# EAGLE design RF_TransimpedanceAmp_FDS02 (EAGLE 6.5.0)
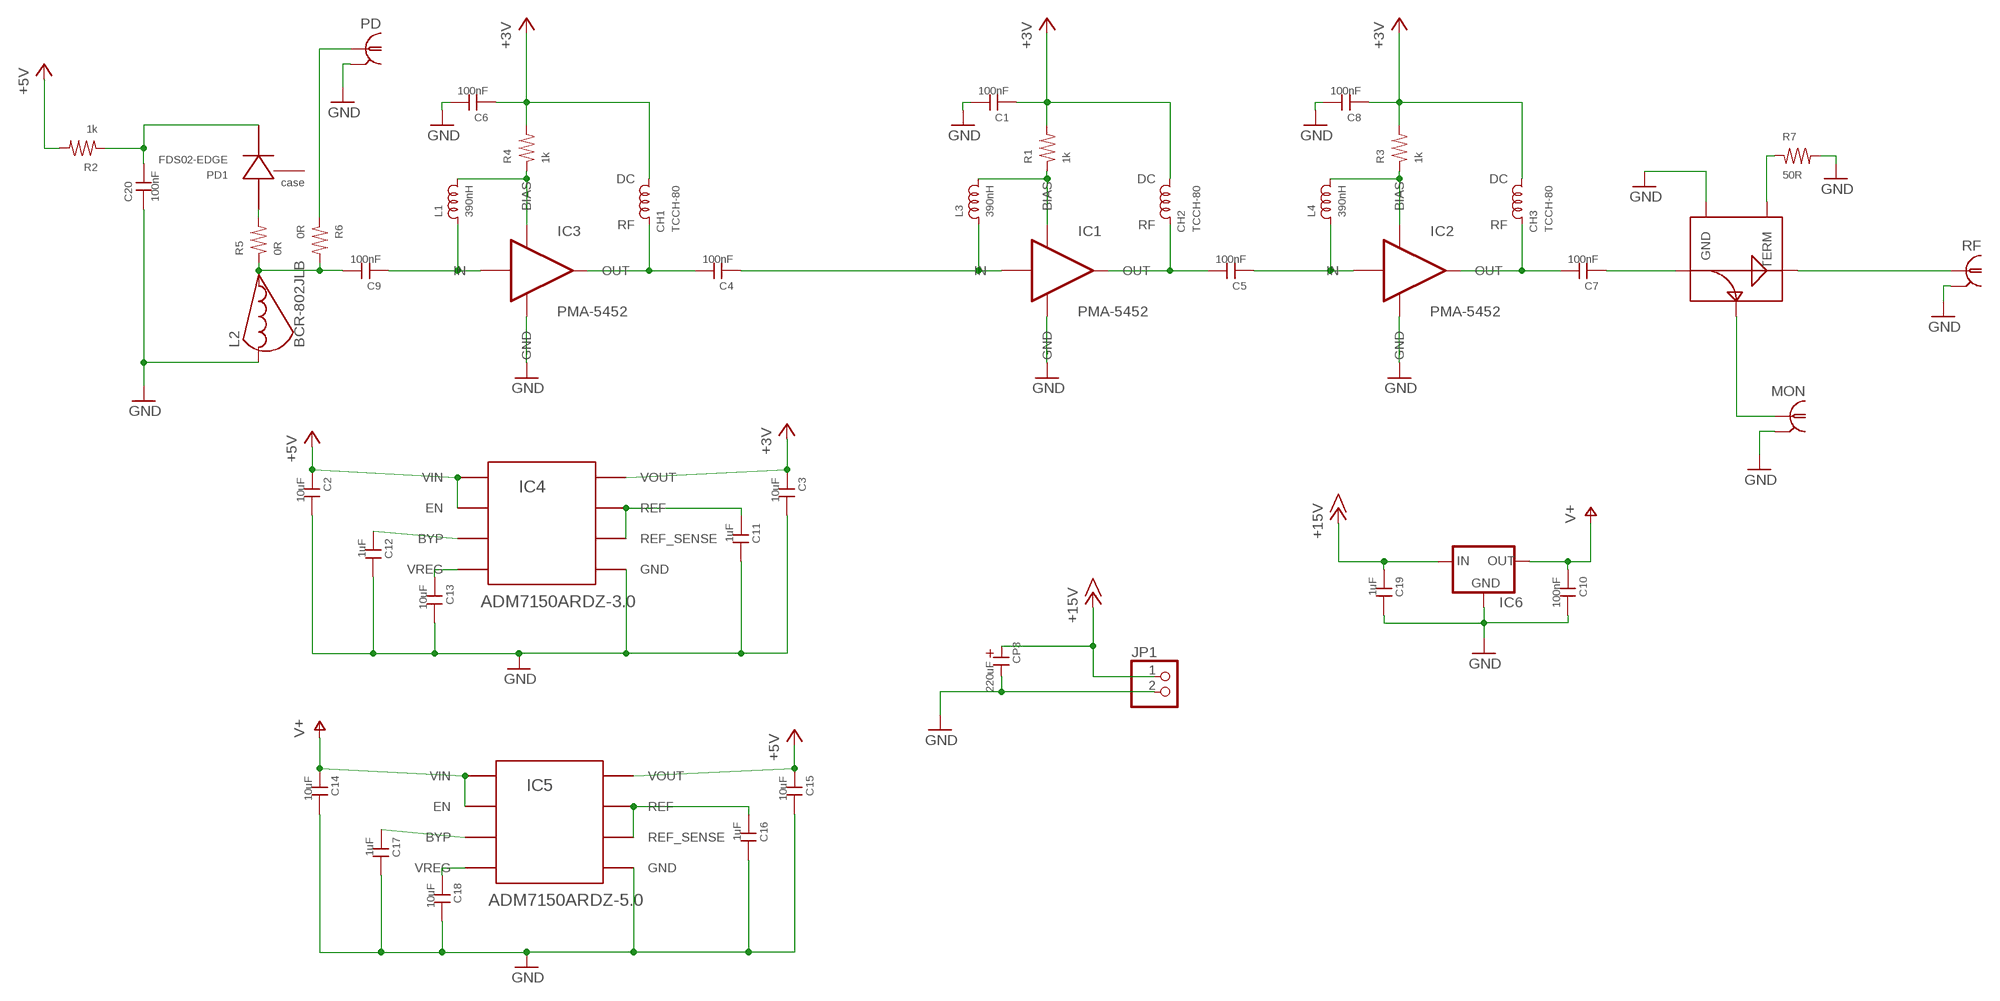
[diagram p0: schematic, sheet 1]

## Parts
C1  100nF  CAP0402  [0402]
C2  10uF  CAP1210  [1210]
C3  10uF  CAP1210  [1210]
C4  100nF  CAP0402  [0402]
C5  100nF  CAP0402  [0402]
C6  100nF  CAP0402  [0402]
C7  100nF  CAP0402  [0402]
C8  100nF  CAP0402  [0402]
C9  100nF  CAP0402  [0402]
C10  100nF  CAP0603  [0603]
C11  1uF  CAP0603  [0603]
C12  1uF  CAP0603  [0603]
C13  10uF  CAP1210  [1210]
C14  10uF  CAP1210  [1210]
C15  10uF  CAP1210  [1210]
C16  1uF  CAP0603  [0603]
C17  1uF  CAP0603  [0603]
C18  10uF  CAP1210  [1210]
C19  1uF  CAP0603  [0603]
C20  100nF  CAP0402  [0402]
CH1  TCCH-80  [GU1604]
CH2  TCCH-80  [GU1604]
CH3  TCCH-80  [GU1604]
CP3  220uF  CAP-POLPANASONIC_F  [PANASONIC_F]
IC1  PMA-5452  [DQ849]
IC2  PMA-5452  [DQ849]
IC3  PMA-5452  [DQ849]
IC4  ADM7150ARDZ-3.0  ADM7150  [SO08]
IC5  ADM7150ARDZ-5.0  ADM7150  [SO08]
IC6  78XX-TO220  [TO220]
JP1  PINHD-1X2  [1X02]
L1  390nH  INDUCTOR-0402  [0402]
L2  BCR-802JLB  [BCR-MED]
L3  390nH  INDUCTOR-0402  [0402]
L4  390nH  INDUCTOR-0402  [0402]
MON  SMAJ502-bulkhead  SMAJ502  [SMA-EDGE]
PD  SMAJ502-bulkhead  SMAJ502  [SMA-EDGE]
PD1  FDS02-EDGE  [FDS02-SIDEMOUNT]
R1  1k  RES0402  [0402]
R2  1k  RES0402  [0402]
R3  1k  RES0402  [0402]
R4  1k  RES0402  [0402]
R5  0R  RES0402  [0402]
R6  0R  RES0402  [0402]
R7  50R  RES0603  [0603]
RF  SMAJ502  [SMA-EDGE]
U$1  ADC-10-4  [BH292]

## Nets
+3V: C1.1 C3.1 C6.1 C8.1 CH1.P$3(DC) CH2.P$3(DC) CH3.P$3(DC) IC4.2(VOUT) R1.2 R3.2 R4.2
+5V: C2.1 C15.1 IC4.7(EN) IC4.8(VIN) IC5.2(VOUT) R2.2
+15V: C19.1 CP3.+ IC6.1(IN) JP1.1
GND: C1.2 C2.2 C3.2 C6.2 C8.2 C10.2 C11.2 C12.2 C13.2 C14.2 C15.2 C16.2 C17.2 C18.2 C19.2 C20.1 CP3.- IC1.P$GND(GND) IC2.P$GND(GND) IC3.P$GND(GND) IC4.4(GND) IC5.4(GND) IC6.2(GND) JP1.2 L2.2 MON.G@1 MON.G@2 MON.G@3 MON.G@4 PD.G@1 PD.G@2 PD.G@3 PD.G@4 R7.2 RF.G@1 RF.G@2 RF.G@3 RF.G@4 U$1.P2(GND)
N$1: C11.1 IC4.5(REF_SENSE) IC4.6(REF)
N$2: C5.2 CH2.P$1(RF) IC1.P$6(OUT)
N$3: IC1.P$7(BIAS) L3.2 R1.1
N$4: RF.1 U$1.P6(OUT)
N$5: C20.2 PD1.P$1(CATHODE) R2.1
N$6: C4.2 CH1.P$1(RF) IC3.P$6(OUT)
N$7: C9.2 L2.1 R5.1 R6.2
N$8: C7.2 CH3.P$1(RF) IC2.P$6(OUT)
N$9: IC3.P$7(BIAS) L1.2 R4.1
N$10: IC2.P$7(BIAS) L4.2 R3.1
N$11: C7.1 U$1.P1(IN)
N$12: MON.1 U$1.P3(COUP)
N$13: C12.1 IC4.3(BYP)
N$14: C13.1 IC4.1(VREG)
N$15: C16.1 IC5.5(REF_SENSE) IC5.6(REF)
N$16: PD1.P$3(ANODE) R5.2
N$17: PD.1 R6.1
N$18: C17.1 IC5.3(BYP)
N$19: C18.1 IC5.1(VREG)
N$20: R7.1 U$1.P4(TERM)
RFPD: C9.1 IC3.P$1(IN) L1.1
RFPD1: C4.1 IC1.P$1(IN) L3.1
RFPD2: C5.1 IC2.P$1(IN) L4.1
V+: C10.1 C14.1 IC5.7(EN) IC5.8(VIN) IC6.3(OUT)
Unconnected: PD1.P$2(CASE)

## Library data of the parts
C1-C20 = rlc-jqi:CAP: SMT Capacitor
CH1-CH3 = rf-jqi:TCCH-80: RF Choke. http://www.minicircuits.com/pdfs/TCCH-80+.pdf
CP3 = rlc-jqi:CAP-POL: Polarized SMT Capacitor
IC1-IC3 = rf-jqi:PMA-5452: Minicircuits PMA-5452 low noise figure amplifier. http://www.minicircuits.com/pdfs/PMA-5452+.pdf
IC4 IC5 = regulator-jqi:ADM7150: ADM7150 Ultra-low noise LDO. 1.7nV/rtHz. Fixed output between 1.5V and 5V.
IC6 = regulator-jqi:78XX
JP1 = pinhead:PINHD-1X2: PIN HEADER
L1 L3 L4 = rlc-jqi:INDUCTOR: SMT Inductor.
L2 = coilcraft-jqi:BCR-802JLB: Coilcraft conical inductor. 8.0uH, 3.39 ohms DC. Irms max = 230mA
MON PD = connector-jqi:SMA; PARTNO: CONSMA006.062-ND
PD1 = RF_TransimpedanceAmp:FDS02: FDS02 FDS02 FC-connectorized photodiode. Ref: https://www.thorlabs.us/thorcat/16600/FDS02-SpecSheet.pdf
R1-R7 = rlc-jqi:RES: SMT Resistor
RF = connector-jqi:SMA
U$1 = RF_TransimpedanceAmp:ADC-10-4: ADC-10-4+ Directional coupler: http://www.minicircuits.com/pdfs/ADC-10-4.pdf

## Board
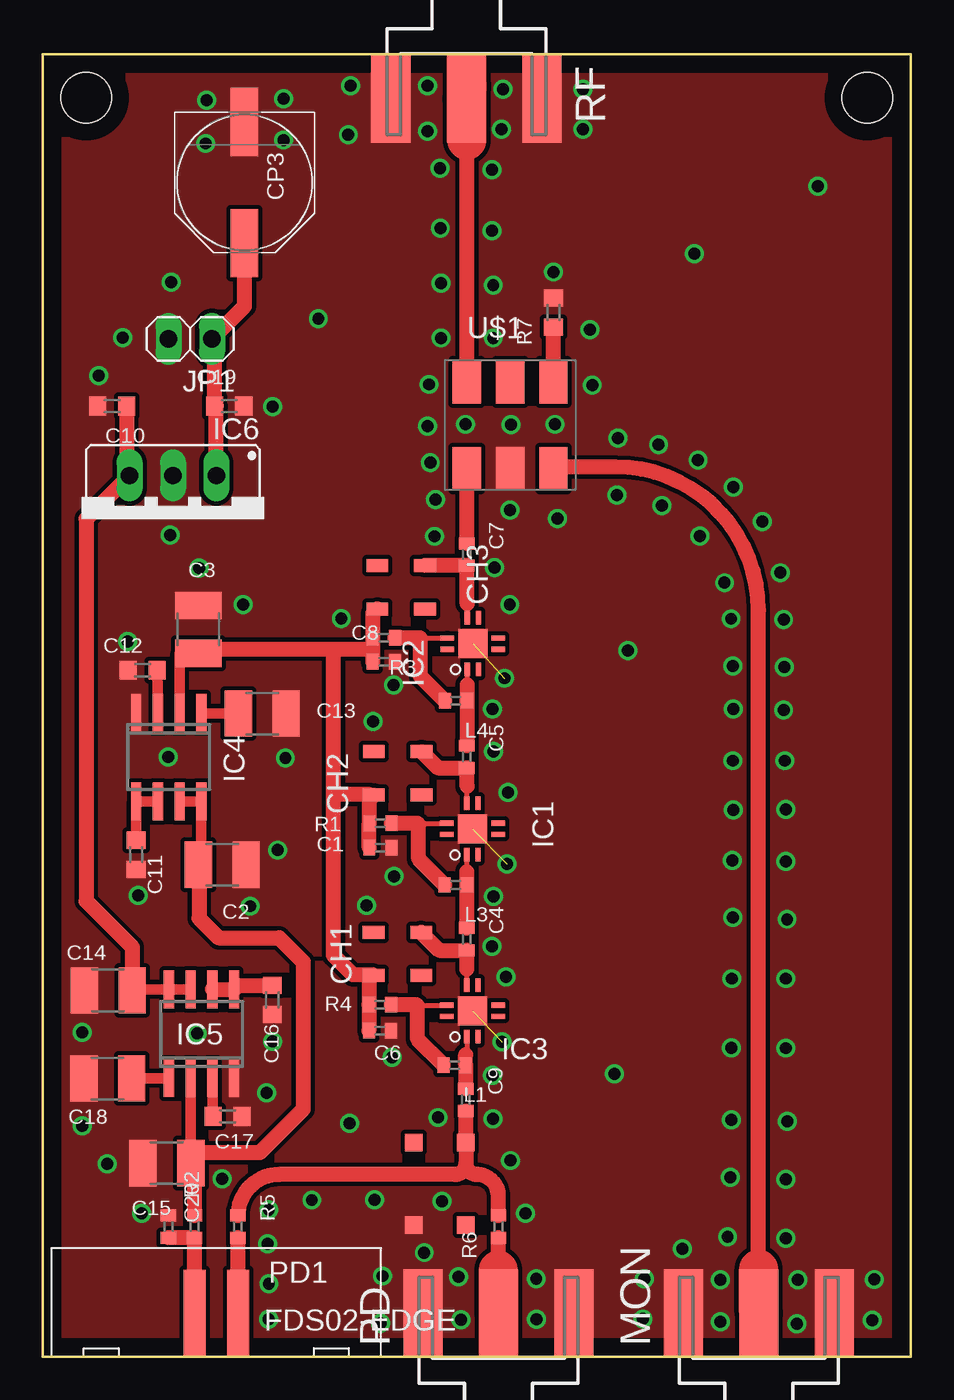
[diagram p1: board, top side]
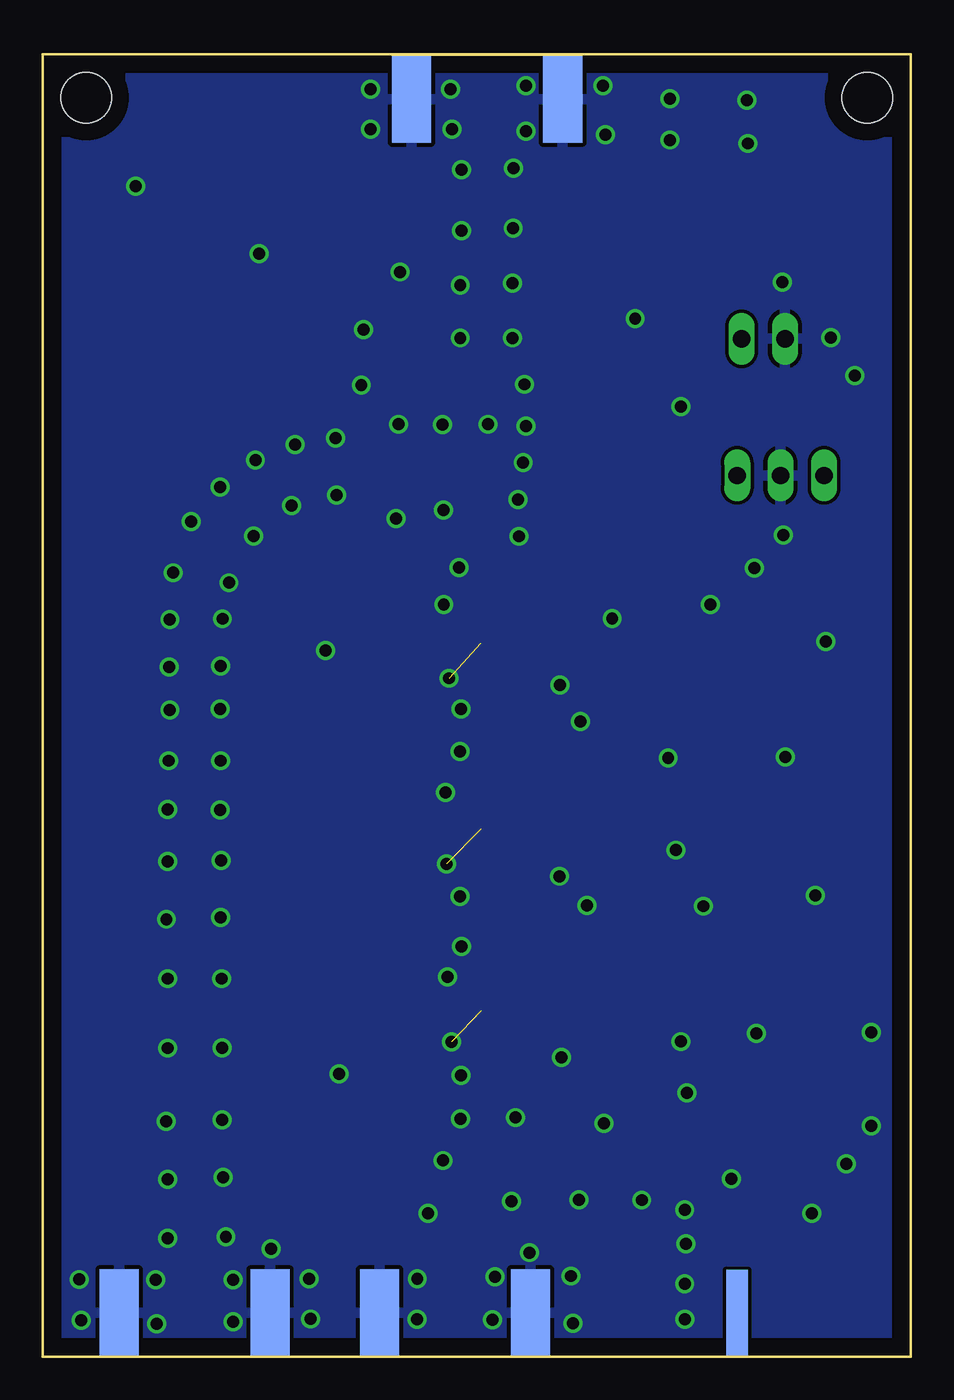
[diagram p2: board, bottom side, seen from below]

Size 50.8 x 76.2 mm. Coordinates in mm from the lower left corner, seen from the top.
Outline: 0,0 50.8,0 50.8,76.2 0,76.2 0,0
Copper layers (1*16): Top 0.035mm / dielectric 1.5mm / Bottom 0.035mm
Design rules: minimum track width 10mil, minimum drill 24mil, track to track 8mil, track to pad 8mil, pad to pad 8mil, via to via 8mil, smd to smd 8mil, copper to edge 40mil, drill to drill 8mil, minimum pad ring 10mil, minimum via ring 8mil, stop-mask expansion 4mil, vias tented up to drill 0mil, thermal gap 10mil
Holes 2.95 mm at 48.26,73.66 2.54,73.66

### Footprints (pad centres in the part's own frame; a part is rotated, then mirrored left to right if it is on the bottom)
0402 = smd 0.7 x 0.9: 1 -0.65,0; 2 0.65,0
1210 = smd 1.6 x 2.7: 1 -1.4,0; 2 1.4,0
0603 = smd 1 x 1.1: 1 -0.85,0; 2 0.85,0
GU1604 = smd 0.762 x 1.27: P$1 -1.27,1.397; P$2 1.27,1.397; P$3 1.27,-1.397; P$4 -1.27,-1.397
PANASONIC_F = smd 4 x 1.6: + 3.55,0; - -3.55,0
DQ849 = smd 0.787 x 0.305: P$1 -1.499,1.27; P$2 -1.499,0.61; P$5 1.499,0.61; P$6 1.499,1.27 | smd 0.305 x 0.787: P$3 -0.33,-0.559; P$4 0.33,-0.559; P$7 0.33,2.438; P$8 -0.33,2.438 | smd 1.702 x 1.702: P$GND 0,0.94
SO08 = smd 2.2 x 0.6: 1 -2.6,2.54; 2 -2.6,1.27; 3 -2.6,0; 4 -2.6,-1.27; 5 2.6,-1.27; 6 2.6,0; 7 2.6,1.27; 8 2.6,2.54
TO220 = drill 1.016 long: 1 -2.54,0; 2 0,0; 3 2.54,0
1X02 = drill 1.016 long: 1 -1.27,0; 2 1.27,0
BCR-MED = smd 1.016 x 1.016: 1 2.413,-1.524; 2 -2.413,1.524; 3-NC -2.413,-1.524; 4-NC 2.413,1.524
SMA-EDGE = smd 5.08 x 2.286: 1 1.295,1.27; G@1 1.295,5.69; G@2 1.295,-3.15 | smd 5.08 x 2.286 bottom: G@3 1.295,5.69; G@4 1.295,-3.15
FDS02-SIDEMOUNT = smd 1.27 x 5.08: P$1 -1.27,2.54; P$3 1.27,2.54 | smd 1.27 x 5.08 bottom: P$2 0,2.54
BH292 = smd 1.651 x 2.54: P1 -2.54,-2.54; P2 0,-2.54; P3 2.54,-2.54; P4 2.54,2.54; P5 0,2.54; P6 -2.54,2.54

### Placement (x,y rotation side)
C1  19.76,29.79 0 top
C2  10.5,28.79 0 top
C3  9.11,42.56 90 top
C4  24.82,24.43 270 top
C5  24.82,35.1 270 top
C6  19.74,19.08 0 top
C7  24.82,46.94 270 top
C8  19.96,40.67 0 top
C9  24.77,15.04 270 top
C10  4.06,55.63 180 top
C11  5.47,29.38 270 top
C12  5.85,40.17 180 top
C13  12.84,37.63 0 top
C14  3.84,21.44 180 top
C15  7.26,11.33 180 top
C16  13.44,20.88 270 top
C17  10.82,14.07 0 top
C18  3.81,16.28 180 top
C19  10.92,55.63 0 top
C20  7.37,7.62 270 top
CH1  20.75,23.57 270 top
CH2  20.78,34.14 270 top
CH3  20.98,45.03 270 top
CP3  11.81,68.71 270 top
IC1  26.09,30.89 90 top
IC2  26.11,41.73 90 top
IC3  26.09,20.24 90 top
IC4  6.74,35.09 270 top
IC5  9.93,18.9 90 top
IC6  7.62,51.56 180 top
JP1  8.64,59.56 180 top
L1  24.1,17.07 180 top
L2  23.24,10.11 90 top
L3  24.17,27.61 180 top
L4  24.18,38.38 180 top
MON  43.18,1.27 90 top
PD  27.94,1.27 90 top
PD1  10.16,0 0 top
R1  19.76,31.22 180 top
R2  8.89,7.62 90 top
R3  19.96,42.06 180 top
R4  19.74,20.6 180 top
R5  11.43,7.62 270 top
R6  26.67,7.62 90 top
R7  29.9,61.09 90 top
RF  23.52,74.88 270 top
U$1  27.36,54.51 0 top

### Tracks (layer width: path | path; a pad name or v marks a point on that pad's centre or on a via)
+3V
  Top 0.61: IC4.2 8.01,41.16 C3.1
  Top 0.864: CH3.P$3 19.31,43.5 R3.2 19.31,41.4 | 19.31,41.4 C8.1 | 19.28,32.77 19.11,32.6 R1.2 C1.1 | C6.1 R4.2 19.09,22.03 CH1.P$3 19.3,22.35 18.16,22.35 17.02,23.5 17.02,32.89 | C3.1 9.35,41.4 17.02,41.4 | 17.02,41.4 19.31,41.4 | CH2.P$3 19.28,32.77 | 17.02,32.89 17.02,41.4 | 19.28,32.77 19.15,32.89 17.02,32.89
+5V
  Top 0.61: IC5.2 8.66,11.94 C15.1 arc90 C15.1 | C2.1 9.28,28.79 IC4.8 IC4.7
  Top 0.864: R2.2 8.89,11.1 arc90 C15.1 | C2.1 9.14,28.75 9.14,25.65 10.29,24.51 13.84,24.51 15.24,23.11 15.24,14.48 12.7,11.94 8.66,11.94
+15V
  Top 0.864: IC6.1 10.16,55.63 C19.1 10.07,59.56 JP1.1 11.81,61.47 CP3.+
GND  (via drill 0.7)  (3 unrouted)
  other vias: 33.66,53.75 36.04,53.37 38.35,52.48 40.41,50.88 42.11,48.87 33.6,50.42 36.25,49.81 38.46,48.03 39.9,45.29 43.15,45.87 43.36,43.13 40.28,43.18 40.39,40.41 40.41,37.9 40.39,34.87 40.41,32 40.36,29.03 40.39,25.7 40.34,22.12 40.31,18.08 40.31,13.87 40.23,10.49 40.08,7.01 37.44,6.32 35.2,4.57 35.13,2.21 39.65,2.06 39.65,4.5 44.2,4.5 44.12,1.93 48.67,4.52 48.54,2.13 43.48,6.93 43.48,10.39 43.59,13.77 43.48,18.06 43.48,22.12 43.56,25.6 43.48,28.98 43.48,32.03 43.43,34.87 43.36,37.85 43.41,40.36 24.74,54.56 27.41,54.53 29.97,54.56 29.9,63.47 26.37,59.61 26.37,62.71 26.29,65.89 26.29,69.47 23.24,69.55 23.27,66.04 23.32,62.81 23.32,59.61 27.36,49.53 26.44,46.18 27.33,44.02 27.03,39.7 26.31,37.9 26.39,35.41 27.23,33.02 27.18,28.83 26.39,26.92 26.29,24 27.1,22.23 26.87,18.42 26.31,16.46 26.34,13.92 27.38,11.48 28.24,8.38 28.88,4.57 28.91,2.18 24.33,4.67 24.49,2.16 19.89,4.72 19.76,1.96 13.21,2.18 22.33,6.1 23.14,14 18.95,26.42 19.33,37.16 17.48,43.21 22.94,48.01 22.99,50.17 22.68,52.32 14.1,73.61 14.1,71.2 9.53,70.99 9.6,73.53 7.52,62.87 4.67,59.64 13.46,55.6 3.28,57.4 7.47,48.08 9.14,46.15 11.73,44.02 14.2,35.03 13.74,29.64 12.14,26.37 13.46,18.44 13.11,15.44 2.31,18.97 2.31,13.51 3.78,11.28 5.79,8.38 13.23,8.61 15.75,9.17 23.37,9.09 19.43,9.19 13.23,4.27 13.16,6.6 10.49,10.41 9.04,18.92 7.34,35.1 4.98,41.86 5.59,27 20.52,39.29 20.55,28.12 20.45,17.53 17.96,13.67 26.92,74.17 26.85,71.83 31.62,74.17 31.62,71.83 18.01,74.37 17.88,71.5 22.53,74.37 22.53,71.7 32.03,60.1 32.16,56.85 22.61,56.9 22.53,54.46 30.12,49.05 34.24,41.33 45.36,68.5 38.13,64.54 16.13,60.73 33.45,16.56
  pour Top (isolate 0.254, no thermals): 0,76.2 50.8,76.2 50.8,0 0,0
  pour Bottom: 0,76.2 50.8,76.2 50.8,0 0,0
N$1
  Top 0.61: IC4.6 IC4.5 C11.1
N$2
  Top 0.305: IC1.P$6 24.82,33.22 arc-90 24.84,33.38
  Top 0.864: 24.84,33.38 24.84,34.43 arc90 C5.2 23.13,34.45 CH2.P$1
N$3
  Top 0.305: 22,31.14 22.07,31.22 IC1.P$7
  Top 0.864: L3.2 22,29.13 22,31.14 21.92,31.22 R1.1
N$4
  Top 0.864: U$1.P6 24.82,71.17
  Top 2.286: 24.82,71.17 24.82,74.6 RF.1
N$5
  Top 0.864: PD1.P$1 R2.1 C20.2
N$6
  Top 0.305: IC3.P$6 24.82,22.68
  Top 0.864: 24.82,22.68 C4.2 23.2,23.79 CH1.P$1
N$7
  Top 0.864: C9.2 L2.1 24.77,11.3 | R6.2 26.67,9.4 arc90 25.4,10.67 arc-90 24.77,11.3 | 24.77,11.3 arc-90 24.13,10.67 13.83,10.67 arc90 R5.1
N$8
  Top 0.305: IC2.P$6 24.84,44.07
  Top 0.864: CH3.P$1 24.8,46.3 C7.2 24.84,44.07
N$9
  Top 0.305: 21.95,20.52 22,20.57 IC3.P$7
  Top 0.864: L1.2 21.95,18.58 21.95,20.52 21.87,20.6 R4.1
N$10
  Top 0.305: 22.1,42.04 22.12,42.06 IC2.P$7
  Top 0.864: L4.2 22.1,39.81 22.1,42.04 22.07,42.06 R3.1
N$11
  Top 0.864: C7.1 U$1.P1
N$12
  Top 0.864: U$1.P3 arc-90 30,52.07 33.5,52.07 arc-90 41.88,43.69 41.88,5.13
  Top 2.286: MON.1 41.88,2.59 41.88,5.13
N$13
  Top 0.61: C12.1 6.76,37.69 IC4.3
N$14
  Top 0.61: C13.1 9.34,37.63 IC4.1
N$15
  Top 0.864: IC5.6 IC5.5 11.43,21.73 C16.1
N$16
  Top 0.864: PD1.P$3 R5.2
N$17
  Top 0.864: 26.67,5.08 R6.1
  Top 2.286: PD.1 26.67,5.08
N$18
  Top 0.61: C17.1 9.92,16.28 arc-90 IC5.3
N$19
  Top 0.61: IC5.1 5.23,16.3 arc90 C18.1
N$20
  Top 0.864: U$1.P4 R7.1
RFPD
  Top 0.305: IC3.P$1 24.82,17.73 arc-90 24.77,17.68
  Top 0.864: C9.1 24.77,17.06 arc90 L1.1 24.75,17.67 arc-90 24.77,17.68
RFPD1
  Top 0.305: 24.82,28.4 IC1.P$1
  Top 0.864: C4.1 L3.1 arc-90 L3.1 24.82,28.4 arc90 24.82,28.4
RFPD2
  Top 0.305: IC2.P$1 24.84,39.32
  Top 0.864: 24.84,39.32 24.83,39.27 L4.1 24.82,38.38 C5.1
V+
  Top 0.61: C14.1 arc-90 5.29,21.5 IC5.8 IC5.7
  Top 0.864: C10.1 4.91,51.56 IC6.3 2.54,49.02 2.54,26.67 5.24,23.98 C14.1

### Text on the board
Document: 34 mil 50ohm trace